# Altium schematic sheet Main_uC.SchDoc: Init Title in DocParam
size A3; Organization: Use Organization_Name in ProjParam; Address1: Eliot Ferragni; Address2: STI-IMT-LSRO; Address3: EPFL; Address4: CH-1015 LAUSANNE; DocumentNumber: 2; Revision: A; SheetNumber: 2; SheetTotal: 10; ApprovedBy: Init ApprovedBy in DocParam; CheckedBy: Init CheckedBy in DocParam; Author: Init Author in DocParam; CompanyName: Init CompanyName in DocParam; DrawnBy: Init DrawBy in DocParam; Engineer: Init Engineer in DocParam; Title2: Init Title2 in DocParam; DocumentName: Init DocumentName in DocParam; ProjectName: Init ProjectName in DocParam
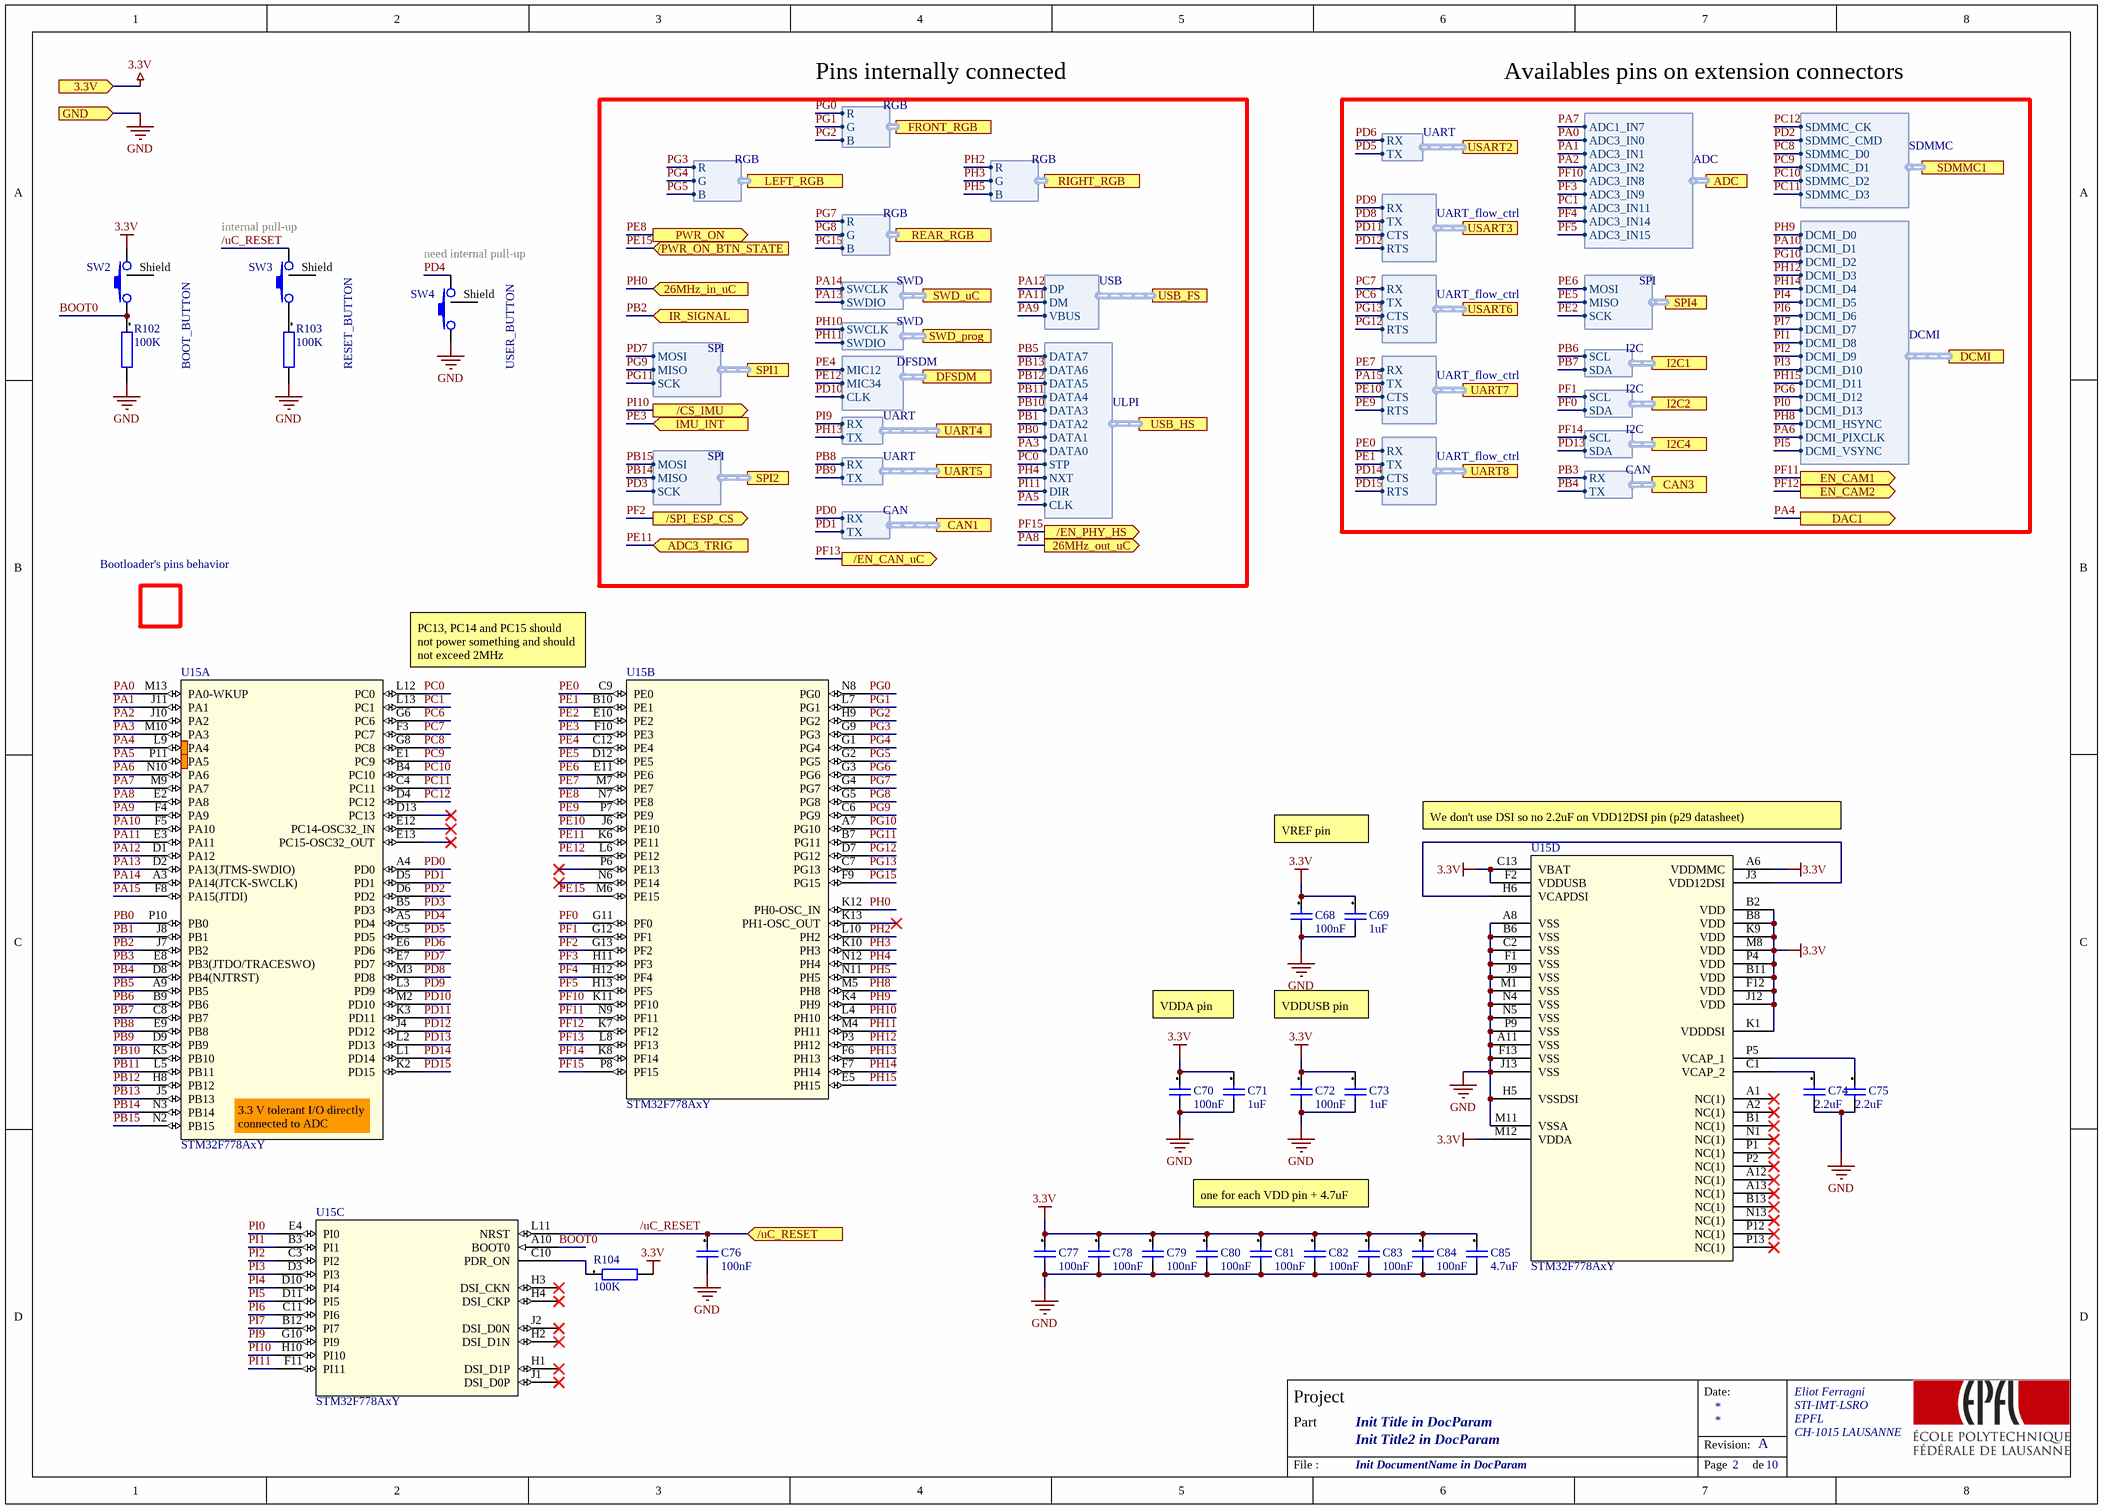
[diagram p0: Main_uC.SchDoc]

## Parts
C68  100nF  [CAPC0201(0603)33_L]
C69  1uF  [CAPC0201(0603)33_L]
C70  100nF  [CAPC0201(0603)33_L]
C71  1uF  [CAPC0201(0603)33_L]
C72  100nF  [CAPC0201(0603)33_L]
C73  1uF  [CAPC0201(0603)33_L]
C74  2.2uF  [CAPC0201(0603)33_L]
C75  2.2uF  [CAPC0201(0603)33_L]
C76  100nF  [CAPC0201(0603)33_L]
C77  100nF  [CAPC0201(0603)33_L]
C78  100nF  [CAPC0201(0603)33_L]
C79  100nF  [CAPC0201(0603)33_L]
C80  100nF  [CAPC0201(0603)33_L]
C81  100nF  [CAPC0201(0603)33_L]
C82  100nF  [CAPC0201(0603)33_L]
C83  100nF  [CAPC0201(0603)33_L]
C84  100nF  [CAPC0201(0603)33_L]
C85  4.7uF  [CAPC0201(0603)33_L]
R102  100K  [RESC0201(0603)_L]
R103  100K  [RESC0201(0603)_L]
R104  100K  [RESC0201(0603)_L]
SW2  button  [C&K_KMR2]  (value not drawn)
SW3  button  [C&K_KMR2]  (value not drawn)
SW4  button  [C&K_KMR2]  (value not drawn)
U15  STM32F778AxY  [WLCSP-180]  (parts A,B,C,D of 4)

## Ports
3.3V (in), 26MHz_in_uC (in), 26MHz_out_uC (out), /CS_IMU (out), /EN_CAN_uC (out), /EN_PHY_HS (out), /PWR_ON_BTN_STATE (in), /SPI_ESP_CS (out), /uC_RESET (in), ADC3_TRIG (in), ADC (harness ADC), CAN1 (harness CAN), CAN3 (harness CAN), DAC1 (out), DCMI (harness DCMI), DFSDM (harness DFSDM), EN_CAM1 (out), EN_CAM2 (out), FRONT_RGB (harness RGB), GND (in), I2C1 (harness I2C), I2C2 (harness I2C), I2C4 (harness I2C), IMU_INT (in), IR_SIGNAL (in), LEFT_RGB (harness RGB), PWR_ON (out), REAR_RGB (harness RGB), RIGHT_RGB (harness RGB), SDMMC1 (harness SDMMC), SPI1 (harness SPI), SPI2 (harness SPI), SPI4 (harness SPI), SWD_prog (harness SWD), SWD_uC (harness SWD), UART4 (harness UART), UART5 (harness UART), UART7 (harness UART_flow_ctrl), UART8 (harness UART_flow_ctrl), USART2 (harness UART), USART3 (harness UART_flow_ctrl), USART6 (harness UART_flow_ctrl), USB_FS (harness USB), USB_HS (harness ULPI)

## Harnesses
SWD: SWDIO, SWCLK
I2C: SDA, SCL
CAN: TX, RX
USB: DM, DP, VBUS
UART: RX, TX
RGB: R, G, B
DFSDM: MIC34, MIC12, CLK
DCMI: DCMI_D0, DCMI_D1, DCMI_D2, DCMI_D3, DCMI_D4, DCMI_D5, DCMI_D6, DCMI_D7, DCMI_D8, DCMI_D9, DCMI_D10, DCMI_D11, DCMI_D12, DCMI_D13, DCMI_HSYNC, DCMI_PIXCLK, DCMI_VSYNC
SDMMC: SDMMC_CK, SDMMC_CMD, SDMMC_D0, SDMMC_D1, SDMMC_D2, SDMMC_D3
SPI: MISO, MOSI, SCK
UART_flow_ctrl: RX, TX, CTS, RTS
ADC: ADC1_IN7, ADC3_IN0, ADC3_IN1, ADC3_IN2, ADC3_IN8, ADC3_IN9, ADC3_IN11, ADC3_IN14, ADC3_IN15
ULPI: DATA7, DATA6, DATA5, DATA4, DATA3, DATA2, DATA1, DATA0, STP, NXT, DIR, CLK

## Nets
3.3V: C68.1 C69.1 C70.1 C71.1 C72.1 C73.1 C77.1 C78.1 C79.1 C80.1 C81.1 C82.1 C83.1 C84.1 C85.1 R104.2 SW2.2 U15.A6(VDDMMC) U15.B2(VDD) U15.B8(VDD) U15.B11(VDD) U15.C13(VBAT) U15.F2(VDDUSB) U15.F12(VDD) U15.J12(VDD) U15.K1(VDDDSI) U15.K9(VDD) U15.M8(VDD) U15.M12(VDDA) U15.P4(VDD) ; port 3.3V
GND: C68.2 C69.2 C70.2 C71.2 C72.2 C73.2 C74.2 C75.2 C76.2 C77.2 C78.2 C79.2 C80.2 C81.2 C82.2 C83.2 C84.2 C85.2 R102.2 R103.2 SW4.1 U15.A8(VSS) U15.A11(VSS) U15.B6(VSS) U15.C2(VSS) U15.F1(VSS) U15.F13(VSS) U15.H5(VSSDSI) U15.J9(VSS) U15.J13(VSS) U15.M1(VSS) U15.M11(VSSA) U15.N4(VSS) U15.N5(VSS) U15.P9(VSS) ; port GND
/uC_RESET: C76.1 SW3.2 U15.L11(NRST) ; port /uC_RESET
BOOT0: R102.1 SW2.1 U15.A10(BOOT0)
PA0: U15.M13(PA0-WKUP) ; port ADC.ADC3_IN0
PA1: U15.J11(PA1) ; port ADC.ADC3_IN1
PA2: U15.J10(PA2) ; port ADC.ADC3_IN2
PA3: U15.M10(PA3) ; port USB_HS.DATA0
PA4: U15.L9(PA4) ; port DAC1
PA5: U15.P11(PA5) ; port USB_HS.CLK
PA6: U15.N10(PA6) ; port DCMI.DCMI_PIXCLK
PA7: U15.M9(PA7) ; port ADC.ADC1_IN7
PA8: U15.E2(PA8) ; port 26MHz_out_uC
PA9: U15.F4(PA9) ; port USB_FS.VBUS
PA10: U15.F5(PA10) ; port DCMI.DCMI_D1
PA11: U15.E3(PA11) ; port USB_FS.DM
PA12: U15.D1(PA12) ; port USB_FS.DP
PA13: U15.D2(PA13(JTMS-SWDIO)) ; port SWD_uC.SWDIO
PA14: U15.A3(PA14(JTCK-SWCLK)) ; port SWD_uC.SWCLK
PA15: U15.F8(PA15(JTDI)) ; port UART7.TX
PB0: U15.P10(PB0) ; port USB_HS.DATA1
PB1: U15.J8(PB1) ; port USB_HS.DATA2
PB2: U15.J7(PB2) ; port IR_SIGNAL
PB3: U15.E8(PB3(JTDO/TRACESWO)) ; port CAN3.RX
PB4: U15.D8(PB4(NJTRST)) ; port CAN3.TX
PB5: U15.A9(PB5) ; port USB_HS.DATA7
PB6: U15.B9(PB6) ; port I2C1.SCL
PB7: U15.C8(PB7) ; port I2C1.SDA
PB8: U15.E9(PB8) ; port UART5.RX
PB9: U15.D9(PB9) ; port UART5.TX
PB10: U15.K5(PB10) ; port USB_HS.DATA3
PB11: U15.L5(PB11) ; port USB_HS.DATA4
PB12: U15.H8(PB12) ; port USB_HS.DATA5
PB13: U15.J5(PB13) ; port USB_HS.DATA6
PB14: U15.N3(PB14) ; port SPI2.MISO
PB15: U15.N2(PB15) ; port SPI2.MOSI
PC0: U15.L12(PC0) ; port USB_HS.STP
PC1: U15.L13(PC1) ; port ADC.ADC3_IN11
PC6: U15.G6(PC6) ; port USART6.TX
PC7: U15.F3(PC7) ; port USART6.RX
PC8: U15.G8(PC8) ; port SDMMC1.SDMMC_D0
PC9: U15.E1(PC9) ; port SDMMC1.SDMMC_D1
PC10: U15.B4(PC10) ; port SDMMC1.SDMMC_D2
PC11: U15.C4(PC11) ; port SDMMC1.SDMMC_D3
PC12: U15.D4(PC12) ; port SDMMC1.SDMMC_CK
PD0: U15.A4(PD0) ; port CAN1.RX
PD1: U15.D5(PD1) ; port CAN1.TX
PD2: U15.D6(PD2) ; port SDMMC1.SDMMC_CMD
PD3: U15.B5(PD3) ; port SPI2.SCK
PD4: SW4.2 U15.A5(PD4)
PD5: U15.C5(PD5) ; port USART2.TX
PD6: U15.E6(PD6) ; port USART2.RX
PD7: U15.E7(PD7) ; port SPI1.MOSI
PD8: U15.M3(PD8) ; port USART3.TX
PD9: U15.L3(PD9) ; port USART3.RX
PD10: U15.M2(PD10) ; port DFSDM.CLK
PD11: U15.K3(PD11) ; port USART3.CTS
PD12: U15.J4(PD12) ; port USART3.RTS
PD13: U15.L2(PD13) ; port I2C4.SDA
PD14: U15.L1(PD14) ; port UART8.CTS
PD15: U15.K2(PD15) ; port UART8.RTS
PE0: U15.C9(PE0) ; port UART8.RX
PE1: U15.B10(PE1) ; port UART8.TX
PE2: U15.E10(PE2) ; port SPI4.SCK
PE3: U15.F10(PE3) ; port IMU_INT
PE4: U15.C12(PE4) ; port DFSDM.MIC12
PE5: U15.D12(PE5) ; port SPI4.MISO
PE6: U15.E11(PE6) ; port SPI4.MOSI
PE7: U15.M7(PE7) ; port UART7.RX
PE8: U15.N7(PE8) ; port PWR_ON
PE9: U15.P7(PE9) ; port UART7.RTS
PE10: U15.J6(PE10) ; port UART7.CTS
PE11: U15.K6(PE11) ; port ADC3_TRIG
PE12: U15.L6(PE12) ; port DFSDM.MIC34
PE15: U15.M6(PE15) ; port /PWR_ON_BTN_STATE
PF0: U15.G11(PF0) ; port I2C2.SDA
PF1: U15.G12(PF1) ; port I2C2.SCL
PF2: U15.G13(PF2) ; port /SPI_ESP_CS
PF3: U15.H11(PF3) ; port ADC.ADC3_IN9
PF4: U15.H12(PF4) ; port ADC.ADC3_IN14
PF5: U15.H13(PF5) ; port ADC.ADC3_IN15
PF10: U15.K11(PF10) ; port ADC.ADC3_IN8
PF11: U15.N9(PF11) ; port EN_CAM1
PF12: U15.K7(PF12) ; port EN_CAM2
PF13: U15.L8(PF13) ; port /EN_CAN_uC
PF14: U15.K8(PF14) ; port I2C4.SCL
PF15: U15.P8(PF15) ; port /EN_PHY_HS
PG0: U15.N8(PG0) ; port FRONT_RGB.R
PG1: U15.L7(PG1) ; port FRONT_RGB.G
PG2: U15.H9(PG2) ; port FRONT_RGB.B
PG3: U15.G9(PG3) ; port LEFT_RGB.R
PG4: U15.G1(PG4) ; port LEFT_RGB.G
PG5: U15.G2(PG5) ; port LEFT_RGB.B
PG6: U15.G3(PG6) ; port DCMI.DCMI_D12
PG7: U15.G4(PG7) ; port REAR_RGB.R
PG8: U15.G5(PG8) ; port REAR_RGB.G
PG9: U15.C6(PG9) ; port SPI1.MISO
PG10: U15.A7(PG10) ; port DCMI.DCMI_D2
PG11: U15.B7(PG11) ; port SPI1.SCK
PG12: U15.D7(PG12) ; port USART6.RTS
PG13: U15.C7(PG13) ; port USART6.CTS
PG15: U15.F9(PG15) ; port REAR_RGB.B
PH0: U15.K12(PH0-OSC_IN) ; port 26MHz_in_uC
PH2: U15.L10(PH2) ; port RIGHT_RGB.R
PH3: U15.K10(PH3) ; port RIGHT_RGB.G
PH4: U15.N12(PH4) ; port USB_HS.NXT
PH5: U15.N11(PH5) ; port RIGHT_RGB.B
PH8: U15.M5(PH8) ; port DCMI.DCMI_HSYNC
PH9: U15.K4(PH9) ; port DCMI.DCMI_D0
PH10: U15.L4(PH10) ; port SWD_prog.SWCLK
PH11: U15.M4(PH11) ; port SWD_prog.SWDIO
PH12: U15.P3(PH12) ; port DCMI.DCMI_D3
PH13: U15.F6(PH13) ; port UART4.TX
PH14: U15.F7(PH14) ; port DCMI.DCMI_D4
PH15: U15.E5(PH15) ; port DCMI.DCMI_D11
PI0: U15.E4(PI0) ; port DCMI.DCMI_D13
PI1: U15.B3(PI1) ; port DCMI.DCMI_D8
PI2: U15.C3(PI2) ; port DCMI.DCMI_D9
PI3: U15.D3(PI3) ; port DCMI.DCMI_D10
PI4: U15.D10(PI4) ; port DCMI.DCMI_D5
PI5: U15.D11(PI5) ; port DCMI.DCMI_VSYNC
PI6: U15.C11(PI6) ; port DCMI.DCMI_D6
PI7: U15.B12(PI7) ; port DCMI.DCMI_D7
PI9: U15.G10(PI9) ; port UART4.RX
PI10: U15.H10(PI10) ; port /CS_IMU
PI11: U15.F11(PI11) ; port USB_HS.DIR
NetC74_1: C74.1 U15.C1(VCAP_2)
NetC75_1: C75.1 U15.P5(VCAP_1)
NetR103_1: R103.1 SW3.1
NetR104_1: R104.1 U15.C10(PDR_ON)
NetU15_H6: U15.H6(VCAPDSI) U15.J3(VDD12DSI)

Not connected (* = marked no-connect by the designer): SW2 Shield; SW3 Shield; SW4 Shield; U15 A1(NC(1))* A2(NC(1))* A12(NC(1))* A13(NC(1))* B1(NC(1))* B13(NC(1))* D13(PC13)* E12(PC14-OSC32_IN)* E13(PC15-OSC32_OUT)* H1(DSI_D1P)* H2(DSI_D1N)* H3(DSI_CKN)* H4(DSI_CKP)* J1(DSI_D0P)* J2(DSI_D0N)* K13(PH1-OSC_OUT)* N1(NC(1))* N6(PE14)* N13(NC(1))* P1(NC(1))* P2(NC(1))* P6(PE13)* P12(NC(1))* P13(NC(1))*

## Notes on the sheet
- Pins internally connected
- Availables pins on extension connectors
- (near SW3) internal pull-up
- (near SW4) need internal pull-up
- BOOT_BUTTON
- RESET_BUTTON
- USER_BUTTON
- Bootloader's pins behavior
- (near U15) PC13, PC14 and PC15 should not power something and should not exceed 2MHz
- VREF pin
- (near U15) We don't use DSI so no 2.2uF on VDD12DSI pin (p29 datasheet)
- VDDA pin
- VDDUSB pin
- (near U15) Bootloader's pins behavior :
  USART1 :
  PA10 (RX) set as input 		-> connected to DCMI_D1						=> OK
  PA9 (TX) set as output high		-> connected to PRTPWR of the USB Hub					=> problem if PRTPWR is low -> Serial Resistance ?
  USART3:
  PB11 (RX) set as input		-> connected to ULPI_D4						=> OK because the HS Phy is turned OFF if we are in the BOOTLOADER (pins are in High impedance state p23 datasheet)
  PB10 (TX) set as output high		-> connected to ULPI_D3						=> OK because the HS Phy is turned OFF if we are in the BOOTLOADER (pins are in High impedance state p23 datasheet)
  PC11 (RX) set as input		-> connected to SDMMC_D3						=> OK (sd card can connect it to VCC with a 50k resistor)
  PC10 (TX) set as output high		-> connected to SDMMC_D2						=> Problem ?
  CAN2 (slave):
  PB5 (RX) set as input			-> connected to ULPI_D7						=> OK
  PB13 (TX) set as output high		-> connected to ULPI_D6						=> OK because the HS Phy is turned OFF if we are in the BOOTLOADER (pins are in High impedance state p23 datasheet)
  I2C1 (slave):
  PB6 (SCL) set as open-drain		-> connected to I2C1 SCL						=> OK
  PB9 (SDA) set as open-drain		-> connected to UART5 TX						=> OK
  I2C2 (slave):
  PF1 (SCL) set as open-drain		-> connected to I2C2 SCL						=> OK
  PF0 (SDA) set as open-drain		-> connected to I2C2 SDA						=> OK
  I2C3 (slave):
  PA8 (SCL) set as open-drain		-> connected to XI of the USB HS Phy (clock)				=> OK
  PC9 (SDA) set as open-drain		-> connected to SDMMC_D1						=> OK
  SPI1 (slave):
  PA7 (MOSI) set as input pull-down	-> connected to ADC1_IN7						=> OK (pull-down is around 40k)
  PA6 (MISO) set as output pull-down	-> connected to DCMI_PIXCLK						=> OK because camera is off if we are in BOOTLOADER
  PA5 (SCK) set as input pull-down	-> connected to ULPI_CK						=> OK
  PA4 (NSS) set as input pull-up		-> connected to DAC_OUT1						=> OK
  SPI2 (slave):
  PI3 (MOSI) set as input pull-down	-> connected to DCMI_D10						=> OK
  PI2 (MISO) set as output pull-down	-> connected to DCMI_D9						=> problem if D9 is low -> serial resistance ?
  PI1 (SCK) set as input pull-down		-> connected to DCMI_D8						=> OK
  PI0 (NSS) set as input pull-up		-> connected to DCMI_D13						=> OK
  SPI4 (slave):
  PE14 (MOSI) set as input pull-down	-> not connected							=> OK
  PE13 (MISO) set as output pull-down	-> not connected							=> OK
  PE12 (SCK) set as input pull-down	-> connected to MIC34						=> OK
  PE11 (NSS) set as input pull-up		-> connected to ADC3_TRIG						=> OK
  USB (DFU):
  PA11 (DM)			-> connected to DM of the USB hub					=> OK
  PA12 (DP) (no pull-up needed)		-> connected to DP of the USB hub					=> OK
- one for each VDD pin + 4.7uF
- Date:
- Project
- Part
- Revision:
- File :
- Page
- de
- (in symbol STM32F77XAXY, part A) 3.3 V tolerant I/O directly connected to ADC

## Library data of the parts
C68-C85 = TBD Capacitor[[/\]]0201[[/\]]1: Capacitor TBD 0201; Preference: 1; Currentie: CHF; Size: 0201; Footprint Acort: 0201; ROHS: True; DateLastUpdate: 2018-10-19 / 8:59:52 AM
R102-R104 = TBD[[/\]]0201[[/\]]1: Resistor ToDo 0201; Preference: 1; Currentie: CHF; Size: 0201; Footprint Acort: 0201; ROHS: True; DateLastUpdate: 2018-10-19 / 9:06:49 AM
SW2-SW4 = C&K KMR2: KMR221GLFS; Manufacturer: Tyco; Manufacturer Nr: 7-188275-6; Preference: 1; Currentie: CHF; Quant_1: 10; Quant_2: 900; Circuit: SPST-NO; Switch Function: Off-Mom; Contact Rating @ Voltage: 0.05A @ 32VDC; Actuator Type: Standard; Actuator Height off PCB, from Pins: 1.90mm; Actuator Orientation: Top Actuated; Outline: 4.60mm x 2.80mm; Illumination: Non-Illuminated; Operating Force: 200gf; Switch Travel: 0.25mm; Mechanical Life: 200,000 Cycles; Footprint Acort: ToDefine; ComponentLink1Description: Datasheet; ComponentLink1URL: http://ecommas.tycoelectronics.com/commerce/DocumentDelivery/DDEController?Action=showdoc&DocId=Customer+Drawing%7F188275%7FR%7Fpdf%7FEnglish%7FC_188275_R.pdf; Supplier: Farnell; Supplier Nr: 1056234; ComponentLink2Description: Farnell link; ComponentLink2URL: http://fr.farnell.com/jsp/displayProduct.jsp?sku=1056234; ROHS: True; Type: SMD; Orientation: Vertical; DateLastUpdate: 2007-12-04 / 09:15:57; Price_1: 1,1; Price_2: 0,924; Supplier 1: Digi-Key; Manufacturer Part Number: KMR221GLFS; Category: Switches; Stock 1: 20549; Pricing 1: 1=0.51, 10=0.493, 25=0.484, 50=0.4656, 100=0.4017, 250=0.3652, 500=0.34694, 1000=0.2739 (USD); Packaging: Cut Tape (CT); Mounting Type: Surface Mount; Termination Style: Gull Wing; Illumination Voltage (Nominal): -; Illumination Type, Color: -; Ingress Protection: -; Features: Grounding Pin; Actuator Material: -; Operating Temperature: -40°C ~ 85°C; ComponentLink3URL: http://www.ck-components.com/index.php?module=media&action=Display&cmpref=14414&lang=en&width=&height=&format=&alt=; ComponentLink3Description: http://www.ck-components.com/index.php?module=media&action=Display&cmpref=14414&lang=en&width=&height=&format=&alt=; Supplier Part Number 1: 401-1427-1-ND
U15 = STM32F77XAXY: Imported; Vendor: STMicroelectronics; C: Copyright (C) 2016 Accelerated Designs. All rights reserved; Manufacturer_Part_Number: stm32f77xaxy; Copyright: Copyright (C) 2016 Accelerated Designs. All rights reserved; RefDes: RefDes; Type: DEV; Value: Value